# Altium project LedController.PrjPCB
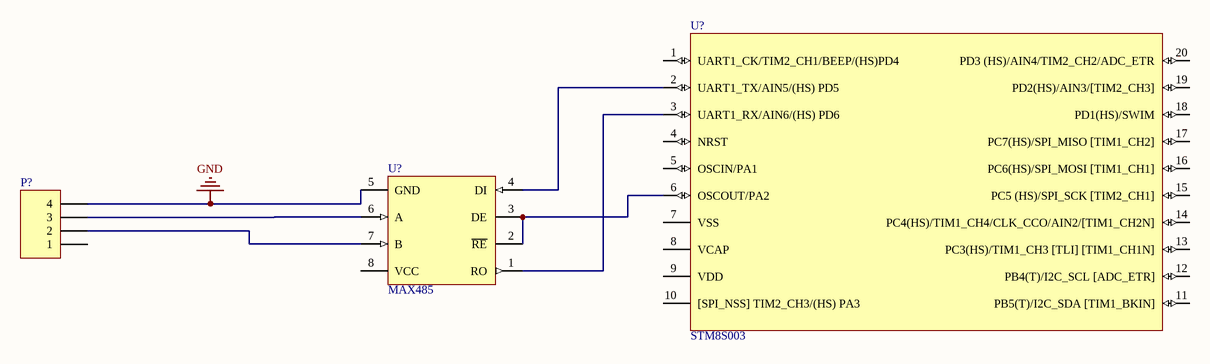
[diagram p0: LedController.SchDoc]
1 sheet, 3 parts. Net scope: global (net labels, ports and power ports of the same name join across sheets).
Board file: LedController.PcbDoc

## Sheet LedController.SchDoc: Led Controller
size A4; Date: 21/01/2019; Author: HungNV103; CompanyName: Viettel Co; Address1: Viettel Building; Address2: Thach That - Ha Noi; SheetNumber: 1; SheetTotal: 1; CurrentTime: 12:00; CurrentDate: 21/01/2019

### Parts
(Parts that share a designator on the sheet are numbered #1, #2 ... from top to bottom, then left to right.)
P?  (no value)  [HDR1X4H]
U?#1  STM8S003  [TSOP65P640X120-20N]
U?#2  MAX485  [SOIC127P600X175-8N]

### Nets
GND: P?.4 U?#2.5(GND)
NetP?_2: P?.2 U?#2.7(B)
NetP?_3: P?.3 U?#2.6(A)
NetU?#1_2: U?#1.2(UART1_TX/AIN5/(HS)_PD5) U?#2.4(DI)
NetU?#1_3: U?#1.3(UART1_RX/AIN6/(HS)_PD6) U?#2.1(RO)
NetU?#1_6: U?#1.6(OSCOUT/PA2) U?#2.2(~{RE}) U?#2.3(DE)

Not connected (* = marked no-connect by the designer): P? 1; U?#1 1(UART1_CK/TIM2_CH1/BEEP/(HS)PD4) 4(NRST) 5(OSCIN/PA1) 7(VSS) 8(VCAP) 9(VDD) 10([SPI_NSS]_TIM2_CH3/(HS)_PA3) 11(PB5(T)/I2C_SDA_[TIM1_BKIN]) 12(PB4(T)/I2C_SCL_[ADC_ETR]) 13(PC3(HS)/TIM1_CH3_[TLI]_[TIM1_CH1N]) 14(PC4(HS)/TIM1_CH4/CLK_CCO/AIN2/[TIM1_CH2N]) 15(PC5_(HS)/SPI_SCK_[TIM2_CH1]) 16(PC6(HS)/SPI_MOSI_[TIM1_CH1]) 17(PC7(HS)/SPI_MISO_[TIM1_CH2]) 18(PD1(HS)/SWIM) 19(PD2(HS)/AIN3/[TIM2_CH3]) 20(PD3_(HS)/AIN4/TIM2_CH2/ADC_ETR); U?#2 8(VCC)

### Notes on the sheet
- Designed By
- Checked By
- Address1:
- Address2:
- Size:       A4
- Sheet:
- /

### Library data of the parts
P? = Header 4H: Header, 4-Pin, Right Angle; LatestRevisionDate: 17-Jul-2002; LatestRevisionNote: Re-released for DXP Platform.; Publisher: Altium Limited
U?#1 = STM8S003: MCU 8-bit STM8S STM8 CISC 8KB Flash 3.3V/5V 20-Pin TSSOP T/R; Value: STM8S003F3; Supplier Part Number 1: 497-18051-1-ND
U?#2 = Max485SOIC8P: IC TXRX RS485/RS422 LOWPWR 8SOIC; Supplier 1: Digi-Key; Supplier Part Number 1: MAX485CSA+-ND